# Altium schematic sheet BaseStation_REV2.6.2.SchDoc: 2.4G_USB_BaseStation
size Letter; Revision: 1.0
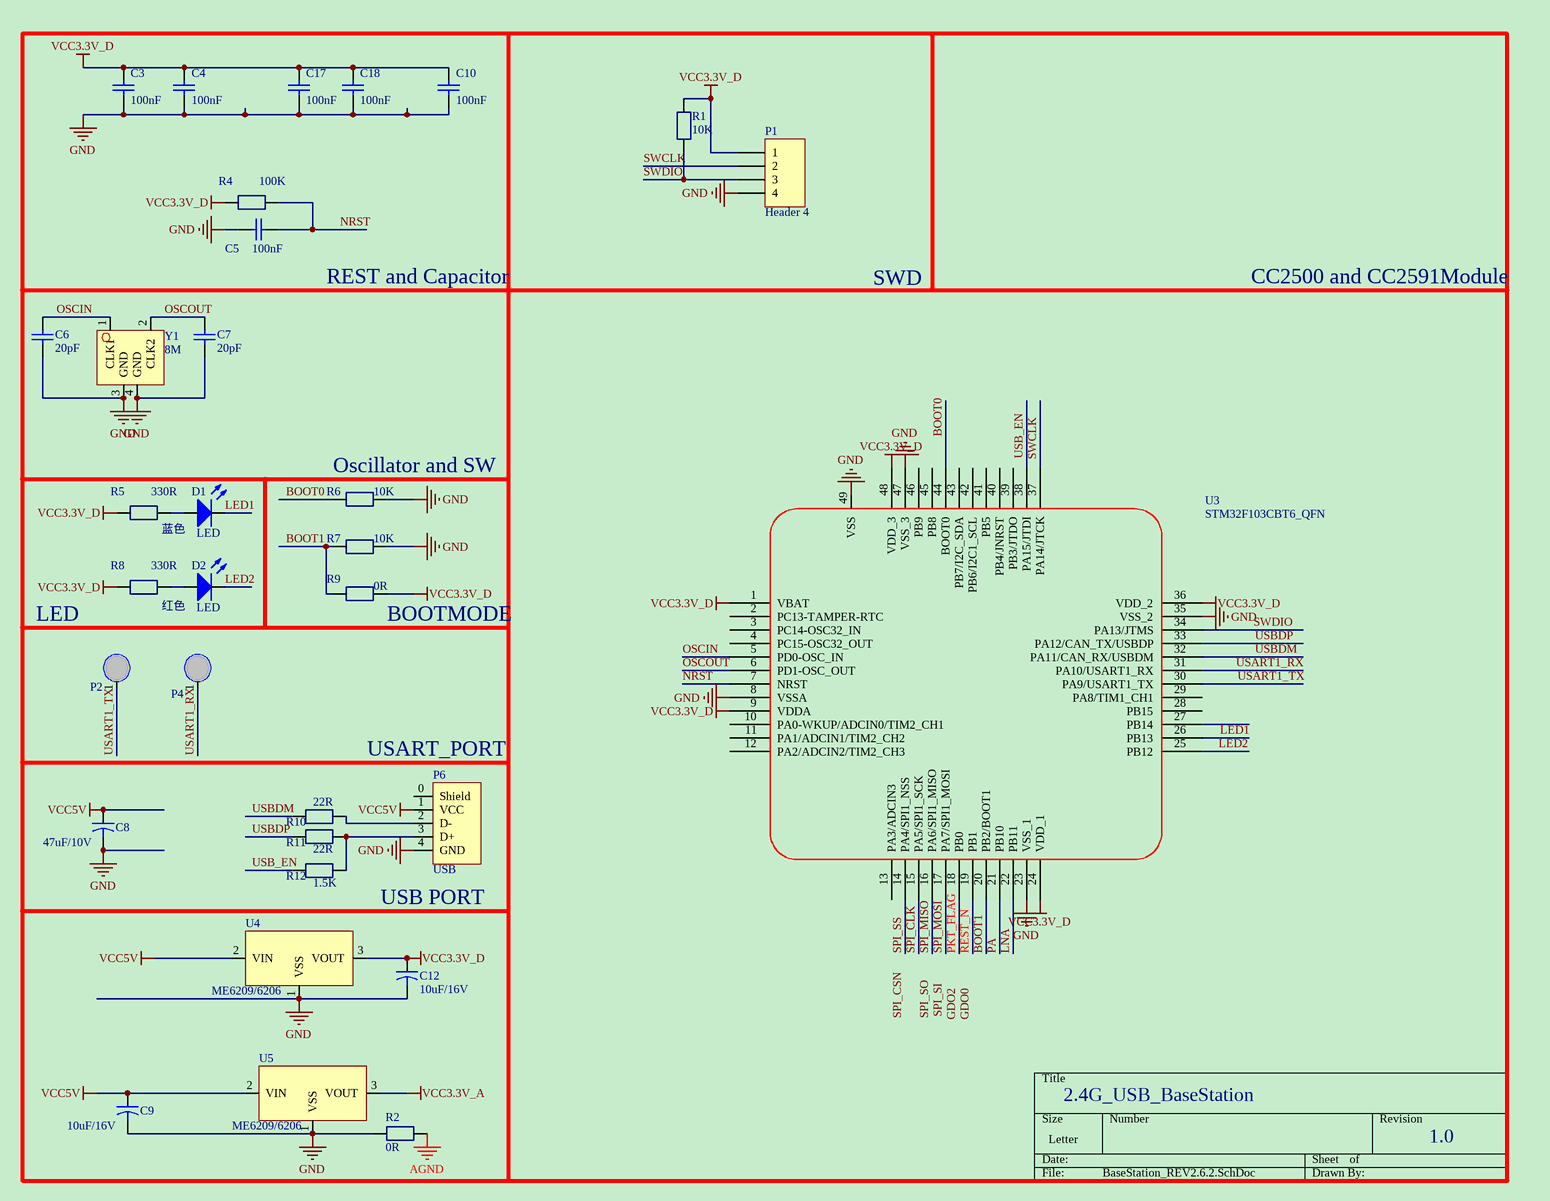
[diagram p0: BaseStation_REV2.6.2.SchDoc]

## Parts
C3  100nF  [0603]
C4  100nF  [0603]
C5  100nF  [0603]
C6  20pF  [0603]
C7  20pF  [0603]
C8  47uF/10V  [C3528]
C9  10uF/16V  [0805]
C10  100nF  [0603]
C12  10uF/16V  [0805]
C17  100nF  [0603]
C18  100nF  [0603]
D1  LED  [LED(0805)]
D2  LED  [LED(0805)]
P1  Header 4  [CON4_2.54MM]
P2  One Pad  [TESTPOINT]  (value not drawn)
P4  One Pad  [TESTPOINT]  (value not drawn)
P6  USB  [USB_JACK]
R1  10K  [0603]
R2  0R  [0603]
R4  100K  [0603]
R5  330R  [0603]
R6  10K  [0603]
R7  10K  [0603]
R8  330R  [0603]
R9  0R  [0603]
R10  22R  [0603]
R11  22R  [0603]
R12  1.5K  [0603]
U3  STM32F103CBT6_QFN  [QFN48]
U4  ME6209/6206  [SOT89-3]
U5  ME6209/6206  [SOT89-3]
Y1  8M  [SMD5032_M4-4]

## Nets
AGND: R2.2
GND: C3.2 C4.2 C5.2 C6.2 C7.2 C8.2 C9.2 C10.2 C12.2 C17.2 C18.2 P1.4 P6.4(GND) R2.1 R6.1 R7.1 U3.8(VSSA) U3.23(VSS_1) U3.35(VSS_2) U3.47(VSS_3) U3.49(VSS) U4.1(VSS) U5.1(VSS) Y1.3(GND) Y1.4(GND)
VCC3.3V_A: U5.3(VOUT)
VCC3.3V_D: C3.1 C4.1 C10.1 C12.1 C17.1 C18.1 P1.1 R1.1 R4.2 R5.2 R8.2 R9.1 U3.1(VBAT) U3.9(VDDA) U3.24(VDD_1) U3.36(VDD_2) U3.48(VDD_3) U4.3(VOUT)
VCC5V: C8.1 C9.1 P6.1(VCC) U4.2(VIN) U5.2(VIN)
BOOT0: R6.2 U3.44(BOOT0)
BOOT1: R7.2 R9.2 U3.20(PB2/BOOT1)
LED1: D1.2(K) U3.26(PB13)
LED2: D2.2(K) U3.25(PB12)
LNA: U3.22(PB11)
NRST: C5.1 R4.1 U3.7(NRST)
OSCIN: C6.1 U3.5(PD0-OSC_IN) Y1.1(CLK1)
OSCOUT: C7.1 U3.6(PD1-OSC_OUT) Y1.2(CLK2)
PA: U3.21(PB10)
PKT_FLAG: U3.18(PB0)
REST_N: U3.19(PB1)
SPI_CLK: U3.15(PA5/SPI1_SCK)
SPI_MISO: U3.16(PA6/SPI1_MISO)
SPI_MOSI: U3.17(PA7/SPI1_MOSI)
SPI_SS: U3.14(PA4/SPI1_NSS)
SWCLK: P1.2 U3.37(PA14/JTCK)
SWDIO: P1.3 R1.2 U3.34(PA13/JTMS)
USART1_RX: P4.1 U3.31(PA10/USART1_RX)
USART1_TX: P2.1 U3.30(PA9/USART1_TX)
USB_EN: R12.2 U3.38(PA15/JTDI)
USBDM: R10.2 U3.32(PA11/CAN_RX/USBDM)
USBDP: R11.2 U3.33(PA12/CAN_TX/USBDP)
NetD1_1: D1.1(A) R5.1
NetD2_1: D2.1(A) R8.1
NetP6_2: P6.2(D-) R10.1
NetP6_3: P6.3(D+) R11.1 R12.1

Not connected (* = marked no-connect by the designer): P6 0(Shield); U3 2(PC13-TAMPER-RTC) 3(PC14-OSC32_IN) 4(PC15-OSC32_OUT) 10(PA0-WKUP/ADCIN0/TIM2_CH1) 11(PA1/ADCIN1/TIM2_CH2) 12(PA2/ADCIN2/TIM2_CH3) 13(PA3/ADCIN3) 27(PB14) 28(PB15) 29(PA8/TIM1_CH1) 39(PB3/JTDO) 40(PB4/JNRST) 41(PB5) 42(PB6/I2C1_SCL) 43(PB7/I2C_SDA) 45(PB8) 46(PB9)

## Notes on the sheet
- REST and Capacitor
- SWD
- CC2500 and CC2591Module
- (near R5) 蓝色
- (near R6) Oscillator and SW
- LED
- (near R8) 红色
- (near R9) BOOTMODE
- (near P6) USART_PORT
- USB PORT
- Labels drawn without touching a wire or pin: GDO0, GDO2, SPI_CSN, SPI_SI, SPI_SO

## Library data of the parts
C3-C7 C10 C17 C18 = Cap: Capacitor; Value: 100pF
C8 C9 C12 = Cap1: Capacitor; Value: 100pF
D1 D2 = LED0: Typical
P1 = Header 4: Header, 4-Pin; LatestRevisionDate: 17-Jul-2002; LatestRevisionNote: Re-released for DXP Platform.; Publisher: Altium Limited
P6 = USB4: USB_Connect
R1 R2 R4-R12 = Res1: Resistor; Value: 1K
U3 = STM32F103CBT6_QFN: MCU
U4 U5 = ME6209/6206: LDO
Y1 = XTAL_4: Crystal Oscillator